# Altium schematic sheet SHDN-IMD-S05-V00-IsolatedCAN.SchDoc: Isolated CANBUS
size A3; DrawnBy: Jonn Dillon; DocumentNumber: 3; Revision: 01; SheetNumber: 3; SheetTotal: 6; Version: 01; Project: IMD Daughter Board 2020; PageSetup: Record=PageOptions|CenterHorizontal=True|CenterVertical=True|PrintScale=0.97|XCorrection=1.00|YCorrection=1.00|PrintKind=0|BorderSize=5000000|LeftOffset=0|BottomOffset=0|Orientation=2|PaperLength=1000|PaperWidth=1000|Scale=100|PaperSource=7|PrintQuality=-4|MediaType=1|DitherType=10|PaperKind=A4|PrintScaleMode=1
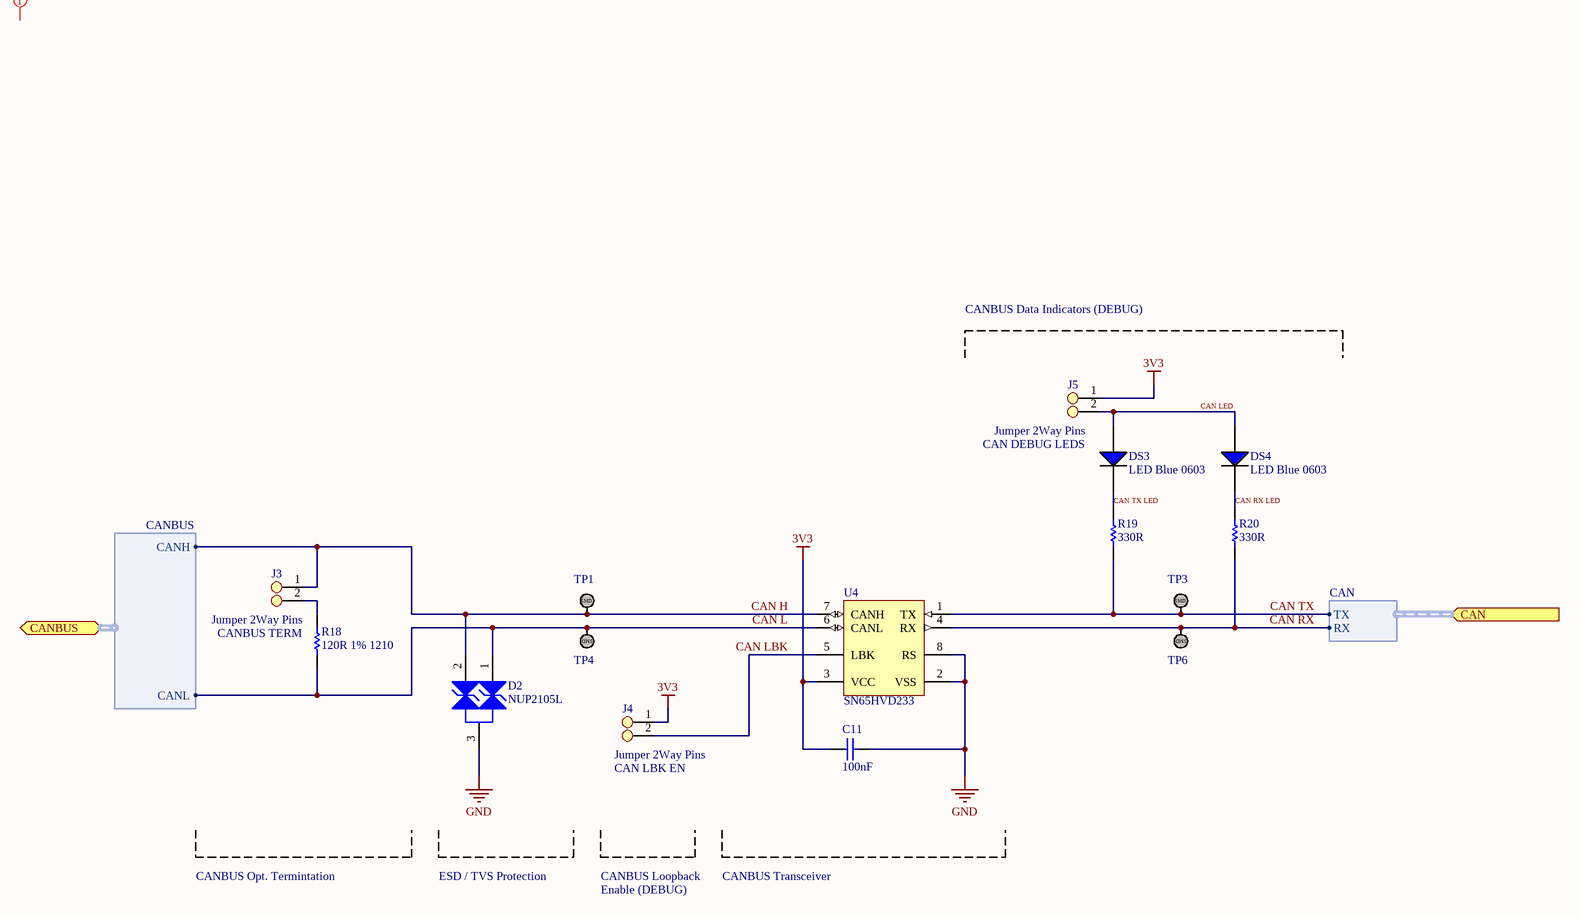
[diagram p0: SHDN-IMD-S05-V00-IsolatedCAN.SchDoc]

## Parts
C11  100nF  [Cap_Ceramic_0603]
D2  NUP2105L  [NUP2105L]
DS3  LED Blue 0603  [LED BLUE 0603]
DS4  LED Blue 0603  [LED BLUE 0603]
J3  Jumper 2Way Pins  [Jumper_2Way_Pin]
J4  Jumper 2Way Pins  [Jumper_2Way_Pin]
J5  Jumper 2Way Pins  [Jumper_2Way_Pin]
R18  120R 1% 1210  [Res_ThinFilm_1210]
R19  330R  [Res_ThinFilm_0603]
R20  330R  [Res_ThinFilm_0603]
TP1  TestPoint_SMD  [TestPointSMD]  (value not drawn)
TP3  TestPoint_SMD  [TestPointSMD]  (value not drawn)
TP4  TestPoint_SMD  [TestPointSMD]  (value not drawn)
TP6  TestPoint_SMD  [TestPointSMD]  (value not drawn)
U4  SN65HVD233  [SN65HVD233DR]

## Ports
CAN (in, harness CAN), CANBUS (bidir, harness CANBUS)

## Harnesses
CANBUS: CANH, CANL
CAN: RX, TX

## Nets
3V3: C11.1 J4.1 J5.1 U4.3(VCC)
GND: C11.2 D2.3 U4.2(VSS) U4.8(RS)
CAN H: D2.2 J3.1 TP1.1 U4.7(CANH) ; port CANBUS.CANH
CAN L: D2.1 R18.1 TP4.1 U4.6(CANL) ; port CANBUS.CANL
CAN LBK: J4.2 U4.5(LBK)
CAN LED: DS3.1(A) DS4.1(A) J5.2
CAN RX: R20.1 TP6.1 U4.4(RX) ; port CAN.RX
CAN RX LED: DS4.2(C) R20.2
CAN TX: R19.1 TP3.1 U4.1(TX) ; port CAN.TX
CAN TX LED: DS3.2(C) R19.2
NetJ3_2: J3.2 R18.2

## Layout directives
mark named ISO: (no net found under the mark)

## Notes on the sheet
- CANBUS Data Indicators (DEBUG)
- CAN DEBUG LEDS
- (near R18) CANBUS TERM
- (near J4) CAN LBK EN
- CANBUS Opt. Termintation
- ESD / TVS Protection
- CANBUS Loopback
- Enable (DEBUG)
- CANBUS Transceiver
- Revision History:
- Sheet Title:
- Rev
- Date
- Description
- Project:
- Size:
- Drawn By:
- A3
- Number:
- Revision:
- Sheet
- Version:
- of
- QUT Motorsport
- O-120, Gardens Point
- 2 George Street
- Brisbane, QLD 4000
- Australia
- Print Date:
- Print Time:
- File Name:
- (in symbol TestPoint_SMD) SMD

## Library data of the parts
C11 = 100nF 100V 5% X7R 0603: Capacitor, Ceramic, SMD, 100nF, 100V, 5%, X7R, 0603
J3-J5 = Jumper 2Way Side Pins
R18 = 120R 1% 1210: Resistor, SMD, 120R, 0.25W, 1%, 1210
R19 R20 = 330R 5% 0603: Resistor, SMD, 330R, 0.1W, 5%, 0603
D2 = NUP2105L: ComponentLink1Description: Datasheet; ComponentLink1URL: https://www.onsemi.cn/PowerSolutions/document/NUP2105L-D.PDF; Parameter 1: *; ComponentLink2Description: LCSC; ComponentLink2URL: https://lcsc.com/product-detail/TVS_ON-Semiconductor-NUP2105LT1G_C14486.html; ComponentLink3Description: Digikey; ComponentLink3URL: https://www.digikey.com.au/product-detail/en/on-semiconductor/SZNUP2105LT1G/SZNUP2105LT1GOSCT-ND/3487669
U4 = SN65HVD233: ComponentLink1Description: LCSC; ComponentLink1URL: https://lcsc.com/product-detail/CAN-ICs_Texas-Instruments_SN65HVD233DRG4_Texas-Instruments-Texas-Instruments-SN65HVD233DRG4_C61643.html; ComponentLink2Description: Digikey; ComponentLink2URL: https://www.digikey.com.au/product-detail/en/texas-instruments/SN65HVD233DR/296-35967-1-ND/4134960; ComponentLink3Description: Datasheet; ComponentLink3URL: https://www.ti.com/lit/ds/symlink/sn65hvd233.pdf?ts=1588560888178; ComponentLink4Description: Ti Product Page; ComponentLink4URL: https://www.ti.com/product/SN65HVD233